# Altium project TS_24 Dashboard.PrjPcb
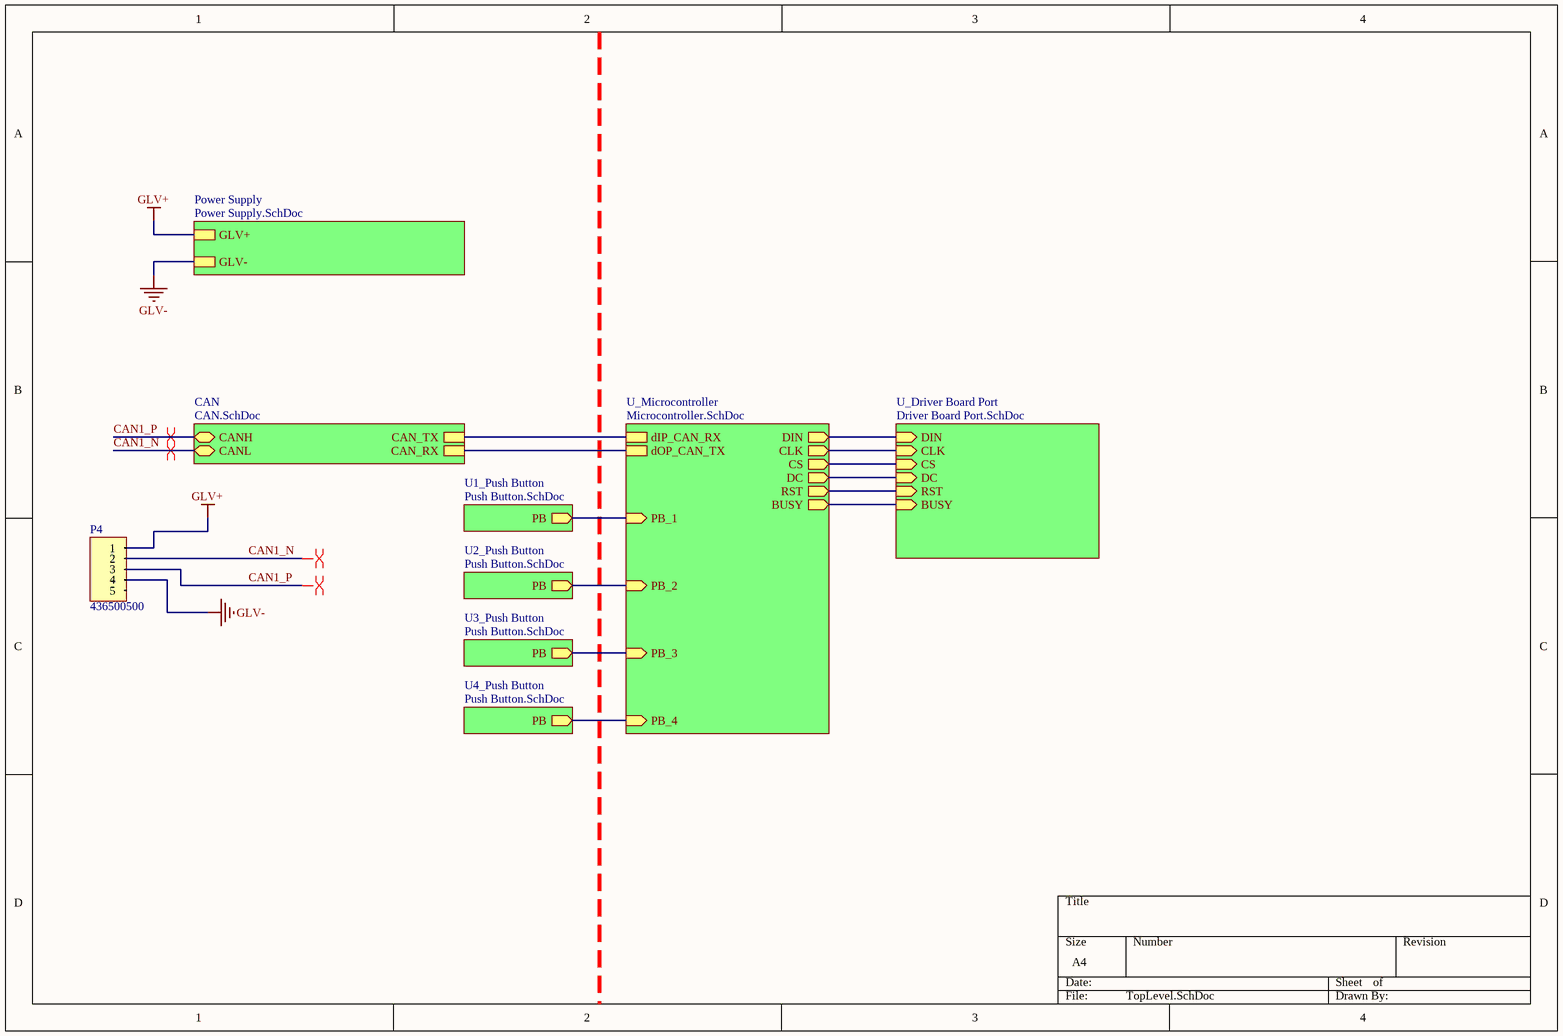
[diagram p0: TopLevel.SchDoc]
6 sheets, 62 parts. Net scope: hierarchical (ports join the sheet entries above them; power ports are global).
Board file: PCB1.PcbDoc
Sheets:
  TopLevel.SchDoc
    Power Supply = Power Supply.SchDoc
    CAN = CAN.SchDoc
    U_Microcontroller = Microcontroller.SchDoc
    U1_Push Button = Push Button.SchDoc
    U2_Push Button = Push Button.SchDoc
    U3_Push Button = Push Button.SchDoc
    U4_Push Button = Push Button.SchDoc
    U_Driver Board Port = Driver Board Port.SchDoc

## Sheet TopLevel.SchDoc
size A4; SheetNumber: 1; SheetTotal: 6

### Parts
P4  436500500  [436500500]

### Sub-sheets
CAN = CAN.SchDoc: CANH (bidir), CANL (bidir), CAN_TX, CAN_RX
Power Supply = Power Supply.SchDoc: GLV+, GLV-
U1_Push Button = Push Button.SchDoc: PB (out)
U2_Push Button = Push Button.SchDoc: PB (out)
U3_Push Button = Push Button.SchDoc: PB (out)
U4_Push Button = Push Button.SchDoc: PB (out)
U_Driver Board Port = Driver Board Port.SchDoc: DIN (in), CLK (in), CS (in), DC (in), RST (in), BUSY (in)
U_Microcontroller = Microcontroller.SchDoc: dIP_CAN_RX, dOP_CAN_TX, DIN (out), CLK (out), CS (out), PB_2 (in), PB_1 (in), BUSY (out), DC (out), RST (out), PB_4 (in), PB_3 (in)

### Nets
GLV+: P4.1 ; sheet Power Supply/GLV+
GLV-: P4.4 ; sheet Power Supply/GLV-
CAN1_N: P4.2 ; sheet CAN/CANL
CAN1_P: P4.3 ; sheet CAN/CANH
NetHeader_1_U1_Push_Button_1: sheet U_Microcontroller/PB_1, sheet U1_Push Button/PB
NetHeader_1_U2_Push_Button_1: sheet U_Microcontroller/PB_2, sheet U2_Push Button/PB
NetHeader_1_U3_Push_Button_1: sheet U_Microcontroller/PB_3, sheet U3_Push Button/PB
NetHeader_1_U4_Push_Button_1: sheet U_Microcontroller/PB_4, sheet U4_Push Button/PB
NetJ1_3: sheet U_Microcontroller/DIN, sheet U_Driver Board Port/DIN
NetJ1_4: sheet U_Microcontroller/CLK, sheet U_Driver Board Port/CLK
NetJ1_5: sheet U_Microcontroller/CS, sheet U_Driver Board Port/CS
NetJ1_6: sheet U_Microcontroller/DC, sheet U_Driver Board Port/DC
NetJ1_7: sheet U_Microcontroller/RST, sheet U_Driver Board Port/RST
NetJ1_8: sheet U_Microcontroller/BUSY, sheet U_Driver Board Port/BUSY
NetR5_1: sheet CAN/CAN_TX, sheet U_Microcontroller/dIP_CAN_RX
NetR6_1: sheet CAN/CAN_RX, sheet U_Microcontroller/dOP_CAN_TX

Not connected (* = marked no-connect by the designer): P4 5

### Layout directives
differential pair: CAN1_N, CAN1_P

### Library data of the parts
P4 = 436500500: Micro-Fit 5x1; Positions: 5; Pitch: 3.0mm; Angle: 90; Flange: No; Contact: Tin; Part Number: 436500500; Row Spacing: 3.0mm; Digikey Part Number: WM1863-ND; Digikey Link: https://www.digikey.com.au/en/products/detail/molex/0436500500/268992

## Sheet Power Supply.SchDoc
size A4; SheetNumber: 4; SheetTotal: 6
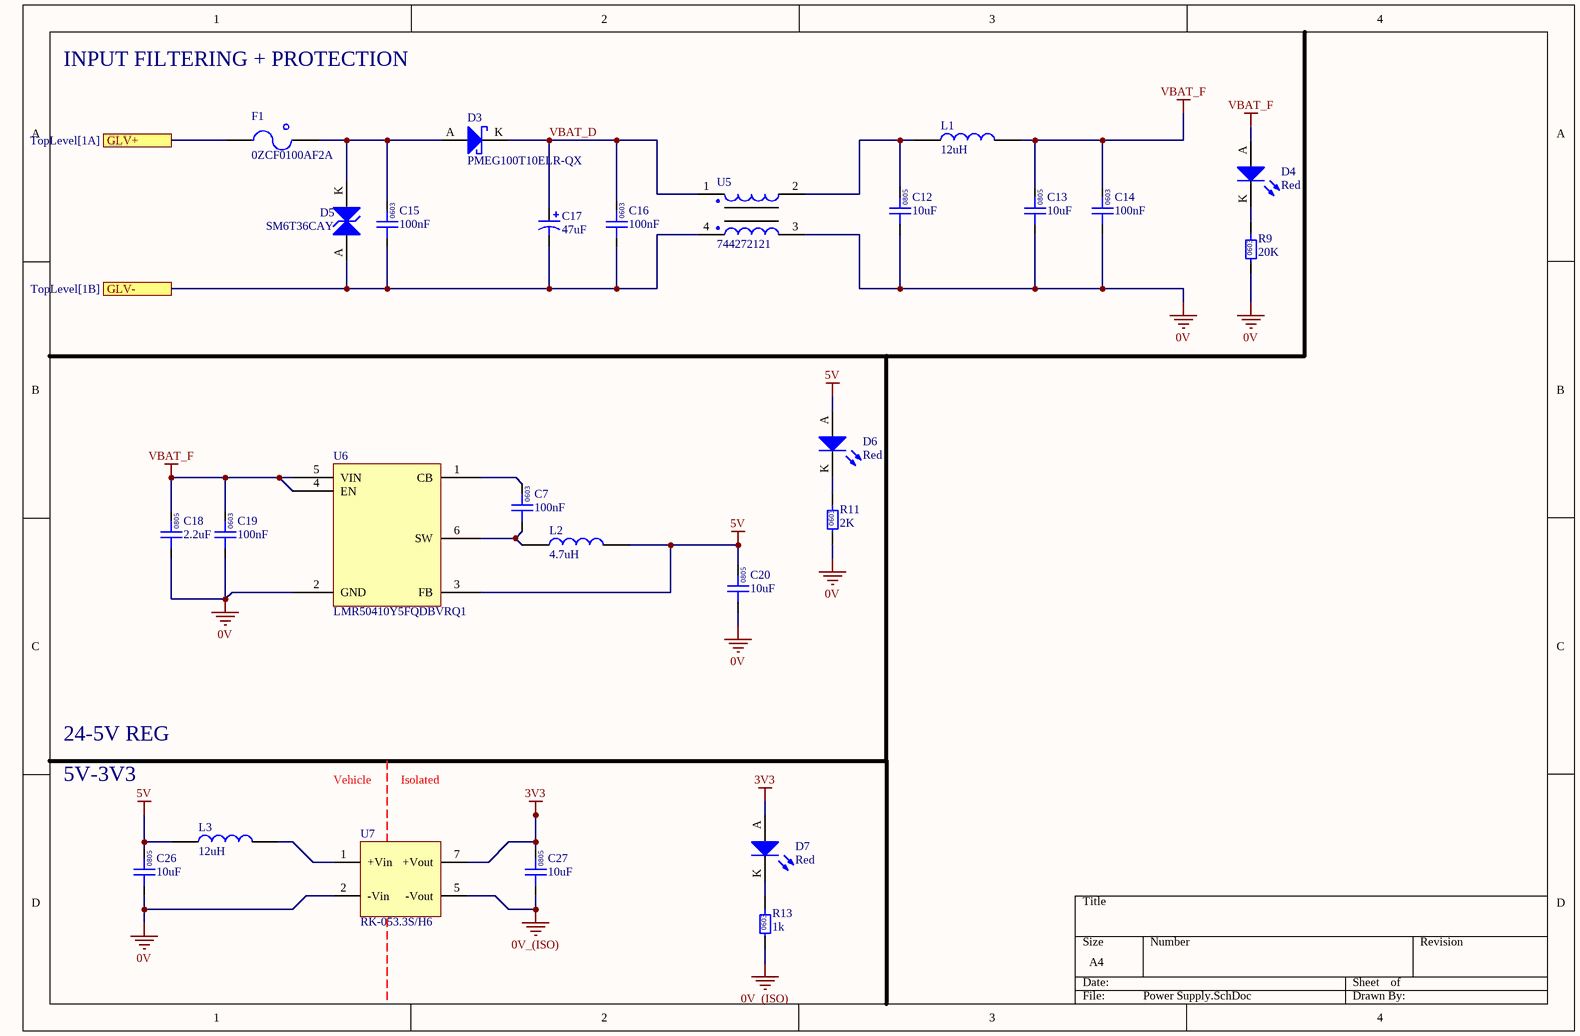
[diagram p1: Power Supply.SchDoc]

### Parts
C7  100nF  [0603]
C12  10uF  [0805]
C13  10uF  [0805]
C14  100nF  [0603]
C15  100nF  [0603]
C16  100nF  [0603]
C17  47uF  [CHEMI-CON ELCO]
C18  2.2uF  [0805]
C19  100nF  [0603]
C20  10uF  [0805]
C26  10uF  [0805]
C27  10uF  [0805]
D3  PMEG100T10ELR-QX  [NXP SOD123W]
D4  Red  [0805 LED]
D5  SM6T36CAY  [ST SMB DIODE]
D6  Red  [0805 LED]
D7  Red  [0805 LED]
F1  0ZCF0100AF2A  [2920]
L1  12uH  [1812]
L2  4.7uH  [SRN3015TA-4R7M]
L3  12uH  [1812]
R9  20K  [0603]
R11  2K  [0603]
R13  1k  [0603]
U5  744272121  [Wurth 4-PC Pad]
U6  LMR50410Y5FQDBVRQ1  [TI-SOT23-6]
U7  RK-053.3S/H6  [RK-053.3S/H6]

### Ports
GLV+ (see TopLevel[1A]), GLV- (see TopLevel[1B])

### Nets
0V: C12.1 C13.1 C14.1 C18.1 C19.1 C20.1 C26.1 R9.1 R11.1 U5.3 U6.2(GND) U7.2(-Vin)
0V_(ISO): C27.1 R13.1 U7.5(-Vout)
3V3: C27.2 D7.A U7.7(+Vout)
5V: C20.2 C26.2 D6.A L2.1 L3.2 U6.3(FB)
GLV+: F1.1 ; port GLV+
GLV-: C15.1 C16.1 C17.1 D5.A U5.4 ; port GLV-
VBAT_F: C13.2 C14.2 C18.2 C19.2 D4.A L1.1 U6.4(EN) U6.5(VIN)
VBAT_D: C16.2 C17.2 D3.K U5.1
NetC7_1: C7.1 L2.2 U6.6(SW)
NetC7_2: C7.2 U6.1(CB)
NetC12_2: C12.2 L1.2 U5.2
NetC15_2: C15.2 D3.A D5.K F1.2
NetD4_K: D4.K R9.2
NetD6_K: D6.K R11.2
NetD7_K: D7.K R13.2
NetL3_1: L3.1 U7.1(+Vin)

### Notes on the sheet
- INPUT FILTERING + PROTECTION
- 5V-3V3
- 24-5V REG
- Vehicle
- Isolated
- (in symbol GCM188L81H104KA57D) 0603
- (in symbol GRM21BR6YA106KE43L) 0805
- (in symbol GRM21BR71E225KE11L) 0805
- (in symbol RC0603FR-071KL) 0603
- (in symbol RC0603FR-072KL) 0603
- (in symbol RC0603FR-0720KL) 0603

### Library data of the parts
C7 C14-C16 C19 = GCM188L81H104KA57D: Manufacturer: muRata; Rated Voltage: 50V; Tolerance: ±10%; Material: MLCC; Temperature Rating: X8L; Part Number: GCM188L81H104KA57D; Value: 100nF; Digikey Part Number: 490-6049-1-ND
C12 C13 C20 C26 C27 = GRM21BR6YA106KE43L: Manufacturer: muRata; Rated Voltage: 50V; Tolerance: 10%; Material: MLCC; Temperature Rating: X5R; Part Number: GRM21BR6YA106KE43L; Value: 10uF; Digikey Part Number: 490-10514-6-ND
C17 = HHXA350ARA470MF61G: Part Number: HHXA350ARA470MF61G
C18 = GRM21BR71E225KE11L: Manufacturer: Murata Electronics; Rated Voltage: 25V; Tolerance: ±10%; Material: MLCC; Temperature Rating: X7R; Part Number: GRM21BR71E225KE11L; Value: 2.2uF; Digikey Part Number: 490-14467-2-ND
D3 = PMEG100T10ELR-QX: Manufacturer: Nexperia USA Inc.; Forward Voltage: 0.75 V @ 1A; Breakdown Voltage: 100 V; Rated Power: 680 mW; Part Number: PMEG100T10ELR-QX; Digikey Part Number: 1727-PMEG100T10ELR-QXCT-ND
D4 D6 D7 = SML-210LTT86: Red LED Indication - Discrete 1.75V 0805 (2012 Metric); Manufacturer: ROHM Semiconductor; Part Number: SML-210LTT86; Colour: Red; Digikey Part Number: 511-1286-1-ND
D5 = SM6T36CAY: Manufacturer: STMicroelectronics; Breakdown Voltage: 30.8 V; Rated Power: 600W; Part Number: SM6T36CAY; Forward Voltage: 30.8 V; Digikey Part Number: 497-10804-1-ND
F1 = 0ZCF0100AF2A: PTC RESET FUSE 60V 1A 292; Manufacturer: Littelfuse Inc.; Part Number: 0ZCF0100AF2A; Digikey Part Number: 507-2070-1-ND; Digikey Link: https://www.digikey.com/product-detail/en/bel-fuse-inc/0ZCF0100AF2A/507-2070-1-ND/6210547
L1 = RLS-126: Manufacturer: Recom; Impedence: 230mOhm; Tolerance: 0.2; Material: Wirewound; Rated Current: 800mA; Part Number: RLS-126; Value: 12uH; Digikey Part Number: 945-3429-ND
L2 = SRN4018-4R7M: Manufacturer: Bourns; Tolerance: 0.2; Impedance: 84mOhms; Rated Current: 1.9A; Material: Wirewound; Part Number: SRN4018-4R7M; Value: 4.7uH; Digikey Part Number: SRN3015TA-4R7MCT-ND
L3 = RLS-126: Manufacturer: Recom; Tolerance: 0.2; Impedance: 230mOhm; Rated Current: 0.8 A; Material: Wirewound; Part Number: RLS-126; Value: 12uH; Digikey Part Number: 945-3429-ND
R9 = RC0603FR-0720KL: Manufacturer: YAGEO; Tolerance: 0.01; Rated Power: 0.1W; Part Number: RC0603FR-0720KL; Value: 20K; Digikey Part Number: 311-20.0KHRCT-ND; Material: FR-07
R11 = RC0603FR-072KL: Manufacturer: YAGEO; Tolerance: 0.01; Rated Power: 0.1W; Part Number: RC0603FR-072KL; Value: 2K; Digikey Part Number: 311-2.00KHRCT-ND; Material: FR-07
R13 = RC0603FR-071KL: Manufacturer: YAGEO; Tolerance: 0.01; Rated Power: 0.1W; Part Number: RC0603FR-071KL; Value: 1k; Digikey Part Number: 311-1.00KHRCT-ND; Material: FR-07
U5 = 744272121: Manufacturer: Wurth Electronics Inc; Value: 120uH @ 100kHz; Impedance: 460 Ohms @ 30MHz; Rated Current: 2.5 A; Part Number: 744272121; Material: Wirewound; Digikey Part Number: 732-1489-1-ND
U6 = LMR50410-Q1: IC REG BUCK 5V 1A SOT23-6; Manufacturer: Texas Instruments; Input Voltage: 4-36V; Part Number: LMR50410-Q1; Output Voltage: 5V; Output Current: 1A; Digikey Part Number: 296-LMR50410Y5FQDBVRQ1CT-ND
U7 = RK-053.3S/H6: DC DC CONVERTER 3.3V 1W; Manufacturer: Recom; Input Voltage: 5V; Output Current: 303mA; Part Number: RK-053.3S/H6; Output Voltage: 3.3V

## Sheet CAN.SchDoc
size A4; SheetNumber: 2; SheetTotal: 6
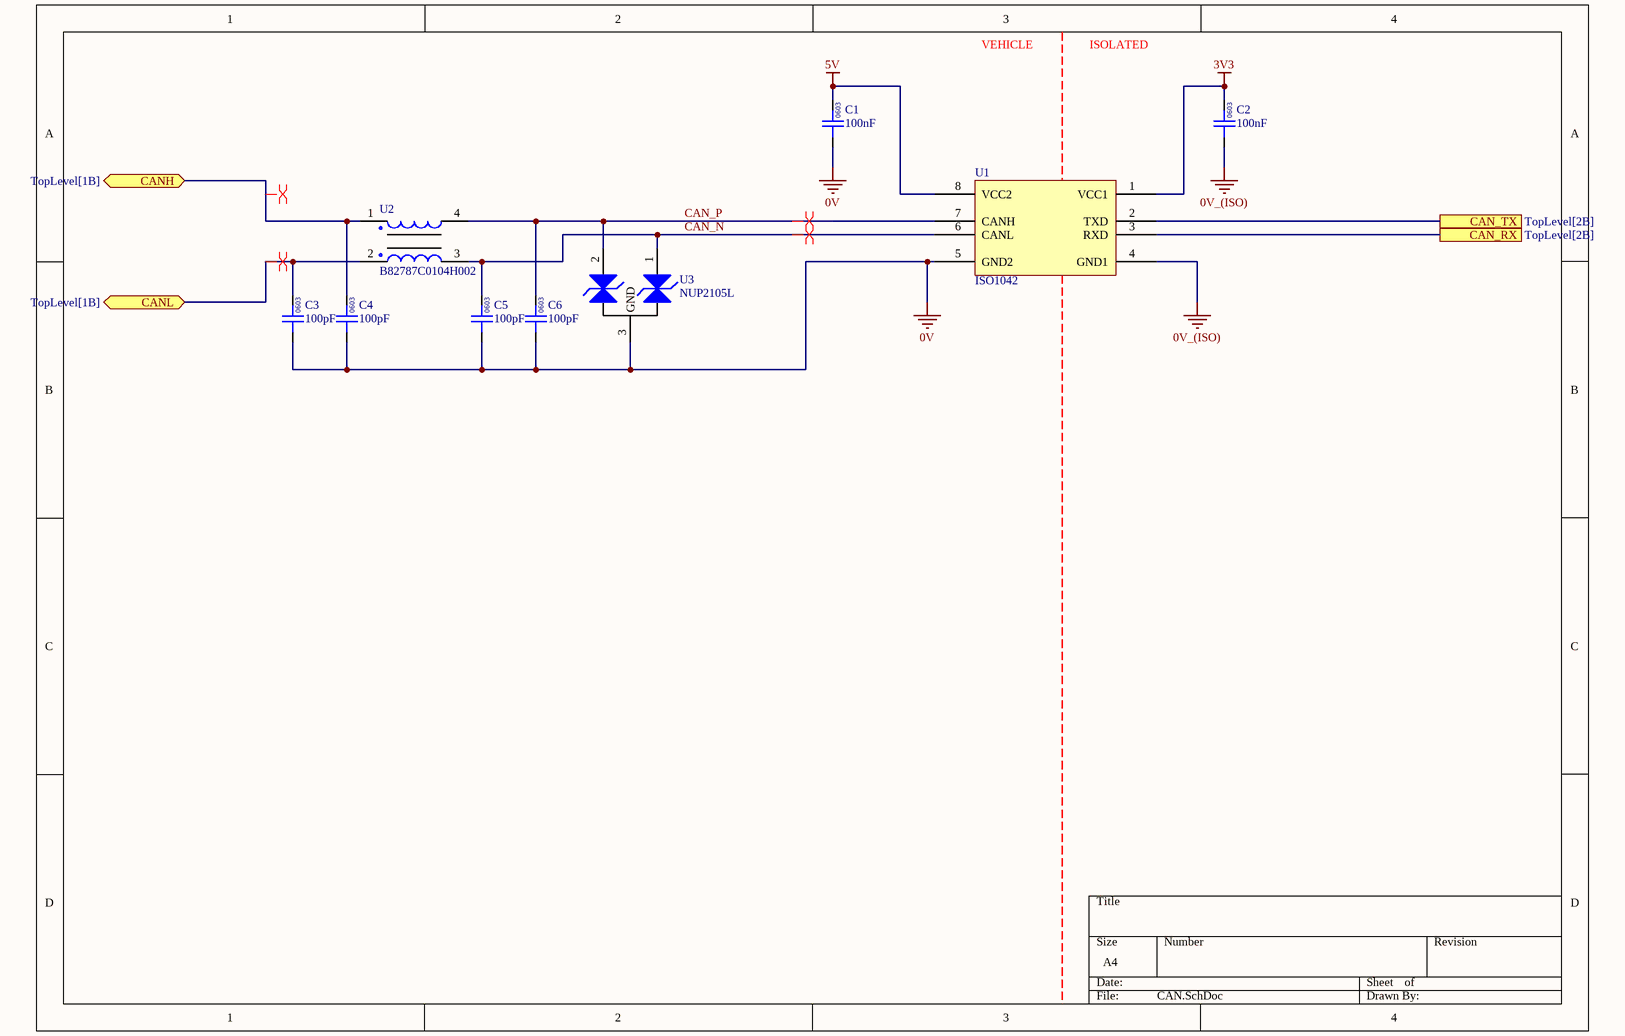
[diagram p2: CAN.SchDoc]

### Parts
C1  100nF  [0603]
C2  100nF  [0603]
C3  100pF  [0603]
C4  100pF  [0603]
C5  100pF  [0603]
C6  100pF  [0603]
U1  ISO1042  [TI-SOIC-8]
U2  B82787C0104H002  [TDK 4-PC Pad]
U3  NUP2105L  [ON SOT-23]

### Ports
CAN_RX (see TopLevel[2B]), CAN_TX (see TopLevel[2B]), CANH (bidir, see TopLevel[1B]), CANL (bidir, see TopLevel[1B])

### Nets
0V: C1.1 C3.1 C4.1 C5.1 C6.1 U1.5(GND2) U3.3(GND)
0V_(ISO): C2.1 U1.4(GND1)
3V3: C2.2 U1.1(VCC1)
5V: C1.2 U1.8(VCC2)
CAN1_N: C3.2 U2.2 ; port CANL
CAN1_P: C4.2 U2.1 ; port CANH
CAN_N: C5.2 U1.6(CANL) U2.3 U3.1(CAN_H)
CAN_P: C6.2 U1.7(CANH) U2.4 U3.2(CAN_L)
NetR5_1: U1.2(TXD) ; port CAN_TX
NetR6_1: U1.3(RXD) ; port CAN_RX

### Layout directives
differential pair: CAN1_N, CAN1_P, CAN_N, CAN_P

### Notes on the sheet
- VEHICLE
- ISOLATED
- (in symbol GCM188L81H104KA57D) 0603
- (in symbol GRM1885C1H101JA01D) 0603

### Library data of the parts
C1 C2 = GCM188L81H104KA57D: as C7 on sheet Power Supply; Part Number: GCM188L81H104KA57D; Value: 100nF; Digikey Part Number: 490-6049-1-ND
C3-C6 = GRM1885C1H101JA01D: Manufacturer: Murata Electronics; Rated Voltage: 50V; Tolerance: ±5%; Material: MLCC; Temperature Rating: C0G, NP0; Part Number: GRM1885C1H101JA01D; Value: 100pF; Digikey Part Number: 490-1427-1-ND
U1 = ISO1042: IC CAN TRANSCEIVER 1/1 8SOIC; Manufacturer: Texas Instruments; Part Number: ISO1042; Digikey Part Number: 296-ISO1042BQDWVQ1-ND
U2 = B82787C0104H002: Manufacturer: EPCOS (TDK); Value: 100µH @ 100kHz; Impedance: 5.8 kOhms @ 10MHz; Rated Current: 150mA; Part Number: B82787C0104H002; Material: Wirewound; Digikey Part Number: 495-4598-1-ND
U3 = NUP2105L: Dual Line CAN Bus Protector; Manufacturer: ON Semiconductor; Part Number: NUP2105L; Digikey Part Number: NUP2105LT1GOSCT-ND; Digikey Link: https://www.digikey.com/product-detail/en/on-semiconductor/NUP2105LT1G/NUP2105LT1GOSCT-ND/1485001

## Sheet Microcontroller.SchDoc
size A4; SheetNumber: 3; SheetTotal: 6
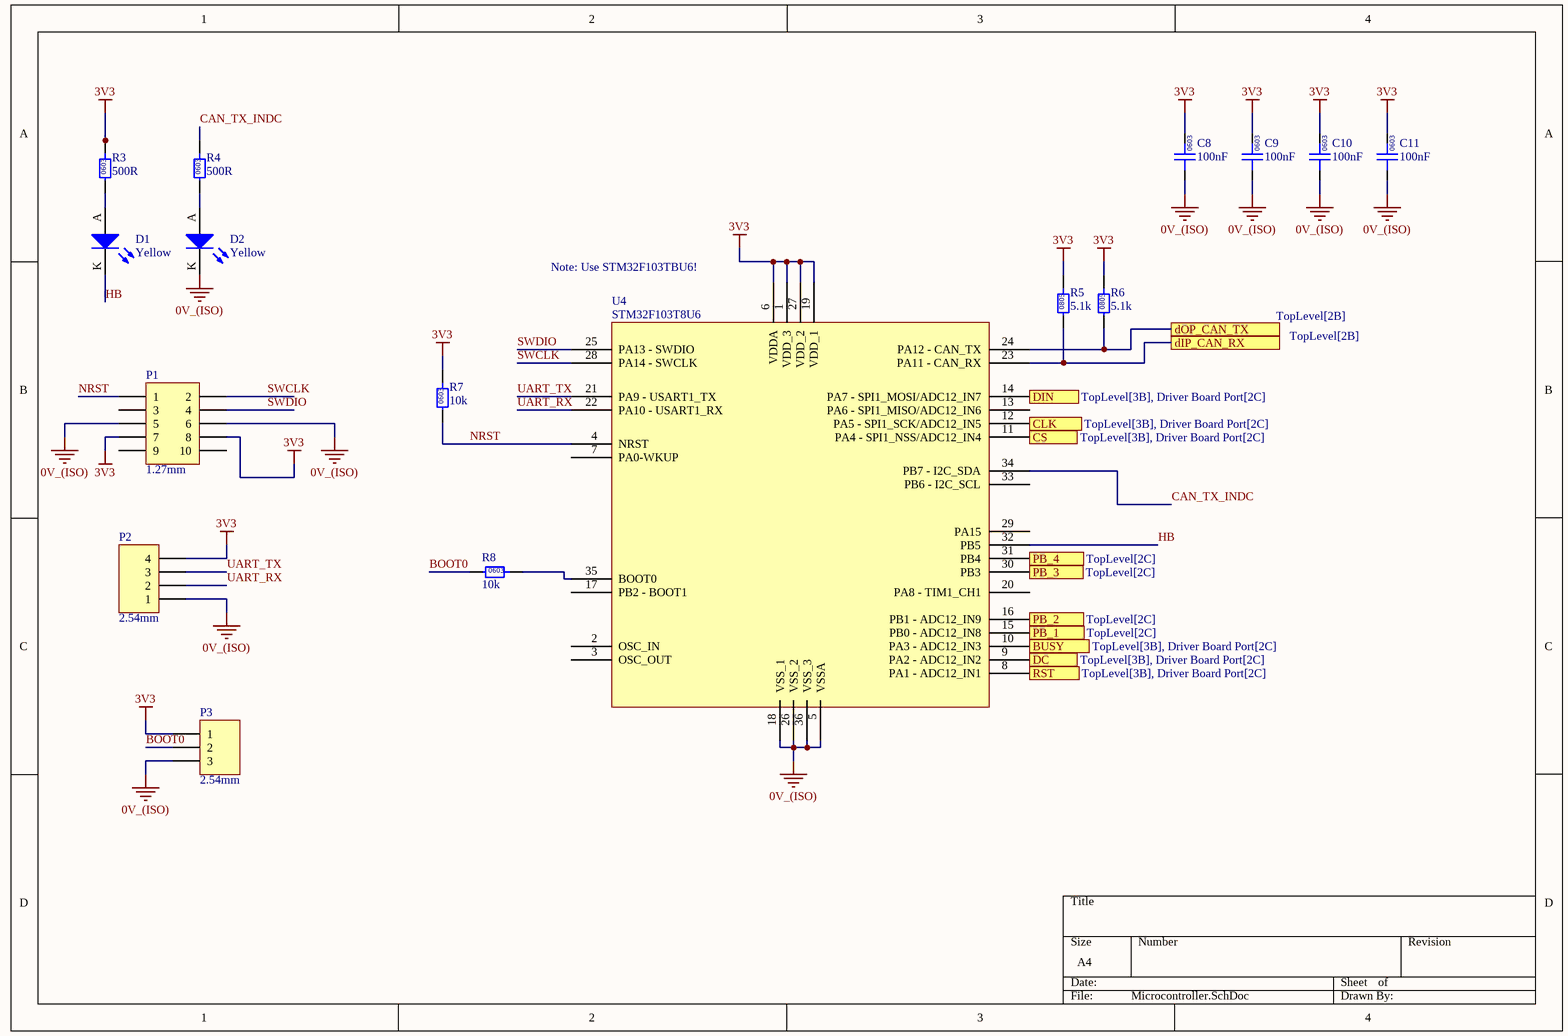
[diagram p3: Microcontroller.SchDoc]

### Parts
C8  100nF  [0603]
C9  100nF  [0603]
C10  100nF  [0603]
C11  100nF  [0603]
D1  Yellow  [0805 LED]
D2  Yellow  [0805 LED]
P1  1.27mm  [3221-10-0300-00]
P2  2.54mm  [TH 2.54mm Header 1x4]
P3  2.54mm  [TH 2.54mm Header 1x3]
R3  500R  [0603]
R4  500R  [0603]
R5  5.1k  [0805]
R6  5.1k  [0805]
R7  10k  [0603]
R8  10k  [0603]
U4  STM32F103T8U6  [STM_QFN-36]

### Ports
BUSY (out, see TopLevel[3B], Driver Board Port[2C]), CLK (out, see TopLevel[3B], Driver Board Port[2C]), CS (out, see TopLevel[3B], Driver Board Port[2C]), DC (out, see TopLevel[3B], Driver Board Port[2C]), DIN (out, see TopLevel[3B], Driver Board Port[2C]), dIP_CAN_RX (see TopLevel[2B]), dOP_CAN_TX (see TopLevel[2B]), PB_1 (in, see TopLevel[2C]), PB_2 (in, see TopLevel[2C]), PB_3 (in, see TopLevel[2C]), PB_4 (in, see TopLevel[2C]), RST (out, see TopLevel[3B], Driver Board Port[2C])

### Nets
0V_(ISO): C8.1 C9.1 C10.1 C11.1 D2.K P1.5 P1.6 P2.1 P3.3 U4.5(VSSA) U4.18(VSS_1) U4.26(VSS_2) U4.36(VSS_3)
3V3: C8.2 C9.2 C10.2 C11.2 P1.7 P1.8 P2.4 P3.1 R3.2 R5.2 R6.2 R7.2 U4.1(VDD_3) U4.6(VDDA) U4.19(VDD_1) U4.27(VDD_2)
BOOT0: P3.2 R8.1
CAN_TX_INDC: R4.2 U4.34(PB7_-_I2C_SDA)
HB: D1.K U4.32(PB5)
NRST: P1.1 R7.1 U4.4(NRST)
SWCLK: P1.2 U4.28(PA14_-_SWCLK)
SWDIO: P1.4 U4.25(PA13_-_SWDIO)
UART_RX: P2.2 U4.22(PA10_-_USART1_RX)
UART_TX: P2.3 U4.21(PA9_-_USART1_TX)
NetD1_A: D1.A R3.1
NetD2_A: D2.A R4.1
NetHeader_1_U1_Push_Button_1: U4.15(PB0_-_ADC12_IN8) ; port PB_1
NetHeader_1_U2_Push_Button_1: U4.16(PB1_-_ADC12_IN9) ; port PB_2
NetHeader_1_U3_Push_Button_1: U4.30(PB3) ; port PB_3
NetHeader_1_U4_Push_Button_1: U4.31(PB4) ; port PB_4
NetJ1_3: U4.14(PA7_-_SPI1_MOSI/ADC12_IN7) ; port DIN
NetJ1_4: U4.12(PA5_-_SPI1_SCK/ADC12_IN5) ; port CLK
NetJ1_5: U4.11(PA4_-_SPI1_NSS/ADC12_IN4) ; port CS
NetJ1_6: U4.9(PA2_-_ADC12_IN2) ; port DC
NetJ1_7: U4.8(PA1_-_ADC12_IN1) ; port RST
NetJ1_8: U4.10(PA3_-_ADC12_IN3) ; port BUSY
NetR5_1: R5.1 U4.23(PA11_-_CAN_RX) ; port dIP_CAN_RX
NetR6_1: R6.1 U4.24(PA12_-_CAN_TX) ; port dOP_CAN_TX
NetR8_2: R8.2 U4.35(BOOT0)

Not connected (* = marked no-connect by the designer): P1 3 9 10; U4 2(OSC_IN) 3(OSC_OUT) 7(PA0-WKUP) 13(PA6_-_SPI1_MISO/ADC12_IN6) 17(PB2_-_BOOT1_) 20(PA8_-_TIM1_CH1) 29(PA15) 33(PB6_-_I2C_SCL)

### Notes on the sheet
- (near U4) Note: Use STM32F103TBU6!
- (in symbol GCM188L81H104KA57D) 0603
- (in symbol RC0603FR-0710KL) 0603
- (in symbol RC0805FR075K1L) 0805
- (in symbol RT0603BRD07500RL) 0603

### Library data of the parts
C8-C11 = GCM188L81H104KA57D: as C7 on sheet Power Supply; Part Number: GCM188L81H104KA57D; Value: 100nF; Digikey Part Number: 490-6049-1-ND
D1 D2 = SML-211YTT86: Yellow LED Indication - Discrete 1.75V 0805 (2012 Metric); Manufacturer: ROHM Semiconductor; Part Number: SML-211YTT86; Colour: Yellow; Digikey Part Number: 511-1293-1-ND
P1 = SMD 1.27mm Header 2x5 (3221-10-0300-00): Positions: 10; Angle: 0; Flange: No; Contact: NA; Part Number: SMD 1.27mm Header 2x5 (3221-10-0300-00); Pitch: 1.27mm; Row Spacing: 1.27mm
P2 = TH 2.54mm Header 1x4: Positions: 4; Angle: 0; Flange: No; Contact: NA; Part Number: TH 2.54mm Header 1x4; Pitch: 2.54mm; Row Spacing: 2.54mm
P3 = TH 2.54mm Header 1x3: Positions: 3; Angle: 0; Flange: No; Contact: NA; Part Number: TH 2.54mm Header 1x3; Pitch: 2.54mm; Row Spacing: 2.54mm
R3 R4 = RT0603BRD07500RL: Manufacturer: YAGEO; Tolerance: 0.01; Rated Power: 0.1W; Part Number: RT0603BRD07500RL; Value: 500R; Material: FR-07; Digikey Part Number: 13-RT0603BRD07500RL-ND
R5 R6 = RC0805FR075K1L: Manufacturer: YAGEO; Tolerance: 0.01; Rated Power: 0.125W; Part Number: RC0805FR075K1L; Value: 5.1k; Material: FR-07; Digikey Part Number: 311-5.10KCRCT-ND
R7 R8 = RC0603FR-0710KL: Manufacturer: YAGEO; Tolerance: 0.01; Rated Power: 0.1W; Part Number: RC0603FR-0710KL; Value: 10k; Digikey Part Number: 311-10.0KHRCT-ND; Material: FR-07
U4 = STM32F103T8U6: ARM® Cortex®-M3 STM32F1 Microcontroller IC 32-Bit 72MHz 64KB (64K x 8) FLASH QFN; Manufacturer: ST Microelectronics; Part Number: STM32F103T8U6; Digikey Part Number: STM32F103T8U6; Digikey Link: https://www.digikey.com/en/products/detail/stmicroelectronics/stm32f103t8u6/1852493

## Sheet Push Button.SchDoc
size A4; SheetNumber: 5; SheetTotal: 6
Used 4 times, as channels U1_Push Button, U2_Push Button, U3_Push Button, U4_Push Button. Parts and nets are listed once, with the designators drawn on the sheet.
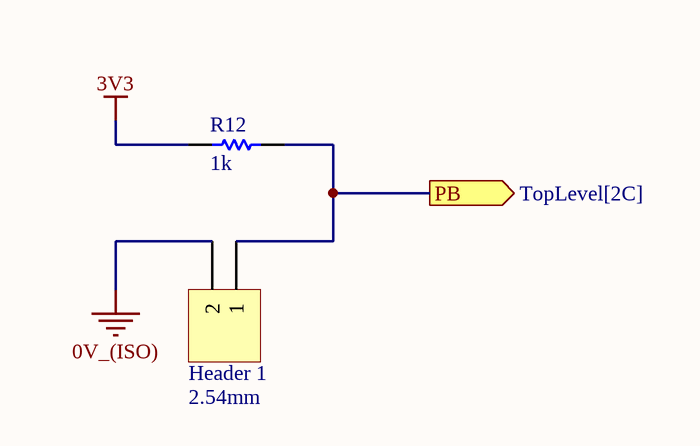
[diagram p4: Push Button.SchDoc]

### Parts
Header_1  2.54mm  [TH 2.54mm Header 1x2]
R12  1k  [0805]

### Ports
PB (out, see TopLevel[2C])

### Nets
0V_(ISO): Header_1.2
3V3: R12.1
PB: Header_1.1 R12.2 ; port PB

### Channels
U1_Push Button: designators Header 1=Header_1_U1_Push_Button R12=R12_U1_Push_Button; ports PB=NetHeader_1_U1_Push_Button_1
U2_Push Button: designators Header 1=Header_1_U2_Push_Button R12=R12_U2_Push_Button; ports PB=NetHeader_1_U2_Push_Button_1
U3_Push Button: designators Header 1=Header_1_U3_Push_Button R12=R12_U3_Push_Button; ports PB=NetHeader_1_U3_Push_Button_1
U4_Push Button: designators Header 1=Header_1_U4_Push_Button R12=R12_U4_Push_Button; ports PB=NetHeader_1_U4_Push_Button_1

### Library data of the parts
Header_1 = TH 2.54mm Header 1x2: Positions: 2; Angle: 0; Flange: No; Contact: NA; Part Number: TH 2.54mm Header 1x2; Pitch: 2.54mm; Row Spacing: 2.54mm
R12 = RC0805FR071KL: Manufacturer: YAGEO; Tolerance: 0.01; Rated Voltage: 0.125W; Part Number: RC0805FR071KL; Value: 1k; Material: FR-07; Digikey Part Number: 311-1.00KCRCT-ND

## Sheet Driver Board Port.SchDoc
size A4; SheetNumber: 6; SheetTotal: 6
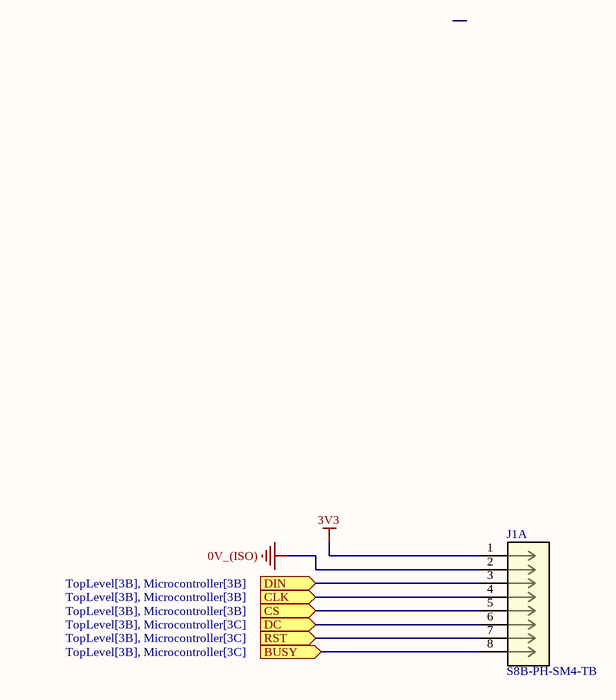
[diagram p5: Driver Board Port.SchDoc]

### Parts
J1  S8B-PH-SM4-TB  [CONN_S8B-PH-SM4-TB_JST]  (part A of 2)

### Ports
BUSY (in, see TopLevel[3B], Microcontroller[3C]), CLK (in, see TopLevel[3B], Microcontroller[3B]), CS (in, see TopLevel[3B], Microcontroller[3B]), DC (in, see TopLevel[3B], Microcontroller[3C]), DIN (in, see TopLevel[3B], Microcontroller[3B]), RST (in, see TopLevel[3B], Microcontroller[3C])

### Nets
0V_(ISO): J1.2
3V3: J1.1
NetJ1_3: J1.3 ; port DIN
NetJ1_4: J1.4 ; port CLK
NetJ1_5: J1.5 ; port CS
NetJ1_6: J1.6 ; port DC
NetJ1_7: J1.7 ; port RST
NetJ1_8: J1.8 ; port BUSY

### Library data of the parts
J1 = S8B-PH-SM4-TB: No Description Available; Mfr_Name: JST; RefDes: RefDes; Type: Type

## Nets that join several sheets
0V: Power Supply (12 pins), CAN (7 pins)
0V_(ISO): Power Supply (C27.1 R13.1 U7.5), CAN (C2.1 U1.4), Microcontroller (13 pins), U1_Push Button (Header_1_U1_Push_Button.2), U2_Push Button (Header_1_U2_Push_Button.2), U3_Push Button (Header_1_U3_Push_Button.2), U4_Push Button (Header_1_U4_Push_Button.2), Driver Board Port (J1.2)
3V3: Power Supply (C27.2 D7.A U7.7), CAN (C2.2 U1.1), Microcontroller (16 pins), U1_Push Button (R12_U1_Push_Button.1), U2_Push Button (R12_U2_Push_Button.1), U3_Push Button (R12_U3_Push_Button.1), U4_Push Button (R12_U4_Push_Button.1), Driver Board Port (J1.1)
5V: Power Supply (6 pins), CAN (C1.2 U1.8)
GLV+: TopLevel (P4.1), Power Supply (F1.1)
GLV-: TopLevel (P4.4), Power Supply (5 pins)
CAN1_N: TopLevel (P4.2), CAN (C3.2 U2.2)
CAN1_P: TopLevel (P4.3), CAN (C4.2 U2.1)
NetHeader_1_U1_Push_Button_1: Microcontroller (U4.15), U1_Push Button (Header_1_U1_Push_Button.1 R12_U1_Push_Button.2)
NetHeader_1_U2_Push_Button_1: Microcontroller (U4.16), U2_Push Button (Header_1_U2_Push_Button.1 R12_U2_Push_Button.2)
NetHeader_1_U3_Push_Button_1: Microcontroller (U4.30), U3_Push Button (Header_1_U3_Push_Button.1 R12_U3_Push_Button.2)
NetHeader_1_U4_Push_Button_1: Microcontroller (U4.31), U4_Push Button (Header_1_U4_Push_Button.1 R12_U4_Push_Button.2)
NetJ1_3: Microcontroller (U4.14), Driver Board Port (J1.3)
NetJ1_4: Microcontroller (U4.12), Driver Board Port (J1.4)
NetJ1_5: Microcontroller (U4.11), Driver Board Port (J1.5)
NetJ1_6: Microcontroller (U4.9), Driver Board Port (J1.6)
NetJ1_7: Microcontroller (U4.8), Driver Board Port (J1.7)
NetJ1_8: Microcontroller (U4.10), Driver Board Port (J1.8)
NetR5_1: CAN (U1.2), Microcontroller (R5.1 U4.23)
NetR6_1: CAN (U1.3), Microcontroller (R6.1 U4.24)